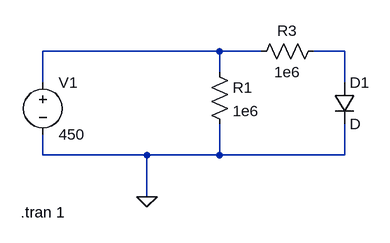
[diagram p0: schematic Isolated Voltage Measurement.asc]
Isolated Voltage Measurement.asc, the LTspice schematic file:
Version 4
SHEET 1 880 680
WIRE 304 80 32 80
WIRE 368 80 304 80
WIRE 496 80 448 80
WIRE 304 112 304 80
WIRE 32 128 32 80
WIRE 496 128 496 80
WIRE 32 240 32 208
WIRE 192 240 32 240
WIRE 304 240 304 192
WIRE 304 240 192 240
WIRE 496 240 496 192
WIRE 496 240 304 240
WIRE 192 304 192 240
FLAG 192 304 0
SYMBOL voltage 32 112 R0
WINDOW 123 0 0 Left 2
WINDOW 39 0 0 Left 2
SYMATTR InstName V1
SYMATTR Value 450
SYMBOL res 288 96 R0
SYMATTR InstName R1
SYMATTR Value 1e6
SYMBOL diode 480 128 R0
SYMATTR InstName D1
SYMBOL res 464 64 R90
WINDOW 0 0 56 VBottom 2
WINDOW 3 32 56 VTop 2
SYMATTR InstName R3
SYMATTR Value 1e6
TEXT -2 328 Left 2 !.tran 1

The netlist it stands for:
* Isolated Voltage Measurement.asc
V1 N001 0 450
R1 N001 0 1e6
D1 N002 0 D
R3 N002 N001 1e6
.model D D
.lib standard.dio
.tran 1
.backanno
.end